# Altium schematic sheet TColour2to3.SchDoc: LiveDesign Evaluation - Alarm Clock
size A4; Organization: Altium Limited; Address1: L3, 12a Rodborough Rd; Address2: Frenchs Forest; Address3: NSW; Address4: Australia 2086; DocumentNumber: 7; SheetNumber: 7; SheetTotal: 10
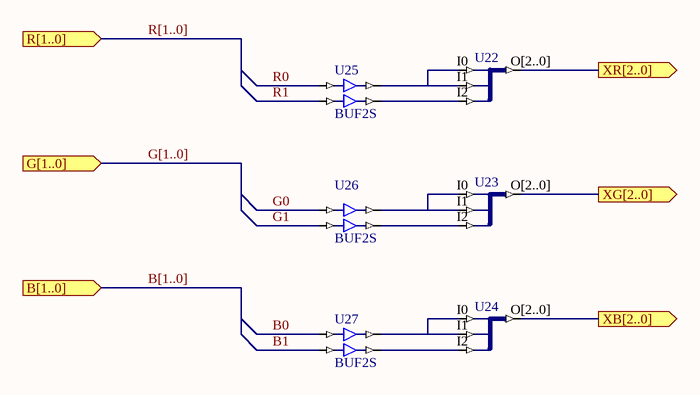
[diagram p0: TColour2to3.SchDoc]

## Parts
U22  J3S_3B  (value not drawn)
U23  J3S_3B  (value not drawn)
U24  J3S_3B  (value not drawn)
U25  BUF2S
U26  BUF2S
U27  BUF2S

## Ports
B[1..0] (in), G[1..0] (in), R[1..0] (in), XB[2..0] (out), XG[2..0] (out), XR[2..0] (out)

## Nets
B0: U27.I0
B1: U27.I1
G0: U26.I0
G1: U26.I1
R0: U25.I0
R1: U25.I1
XB[2..0]: U24.O[2..0] ; port XB[2..0]
XG[2..0]: U23.O[2..0] ; port XG[2..0]
XR[2..0]: U22.O[2..0] ; port XR[2..0]
NetU22_I0: U22.I0 U22.I1 U25.O0
NetU22_I2: U22.I2 U25.O1
NetU23_I0: U23.I0 U23.I1 U26.O0
NetU23_I2: U23.I2 U26.O1
NetU24_I0: U24.I0 U24.I1 U27.O0
NetU24_I2: U24.I2 U27.O1

## Buses and harness runs
bus B[1..0] = port B[1..0]
bus G[1..0] = port G[1..0]
bus R[1..0] = port R[1..0]

## Notes on the sheet
- Title
- Size:
- Date:
- A4
- Number:
- Time:
- Revision:
- Sheet
- of
- File:

## Library data of the parts
U22-U24 = J3S_3B: 3 Single pin inputs to single 3-Bit output bus; ArchiveName: GENERIC; VHDLIB_SIM: GENERIC_LIB; Published: 29-Jan-2004; Publisher: Altium Limited; Core Revision: 1.00.00
U25-U27 = BUF2S: 2-Bit General Purpose (Non-inverting) Buffer, Single Pin Version; ArchiveName: GENERIC; VHDLIB_SIM: GENERIC_LIB; Published: 29-Jan-2004; Publisher: Altium Limited; Core Revision: 1.00.00